# Altium schematic sheet Load_Cell_Acquisition.SchDoc
size A3; Organization: Altium Limited; Address1: L3, 12a Rodborough Rd; Address2: Frenchs Forest; Address3: NSW; Address4: Australia 2086; DocumentNumber: 2; SheetNumber: 2; SheetTotal: 8
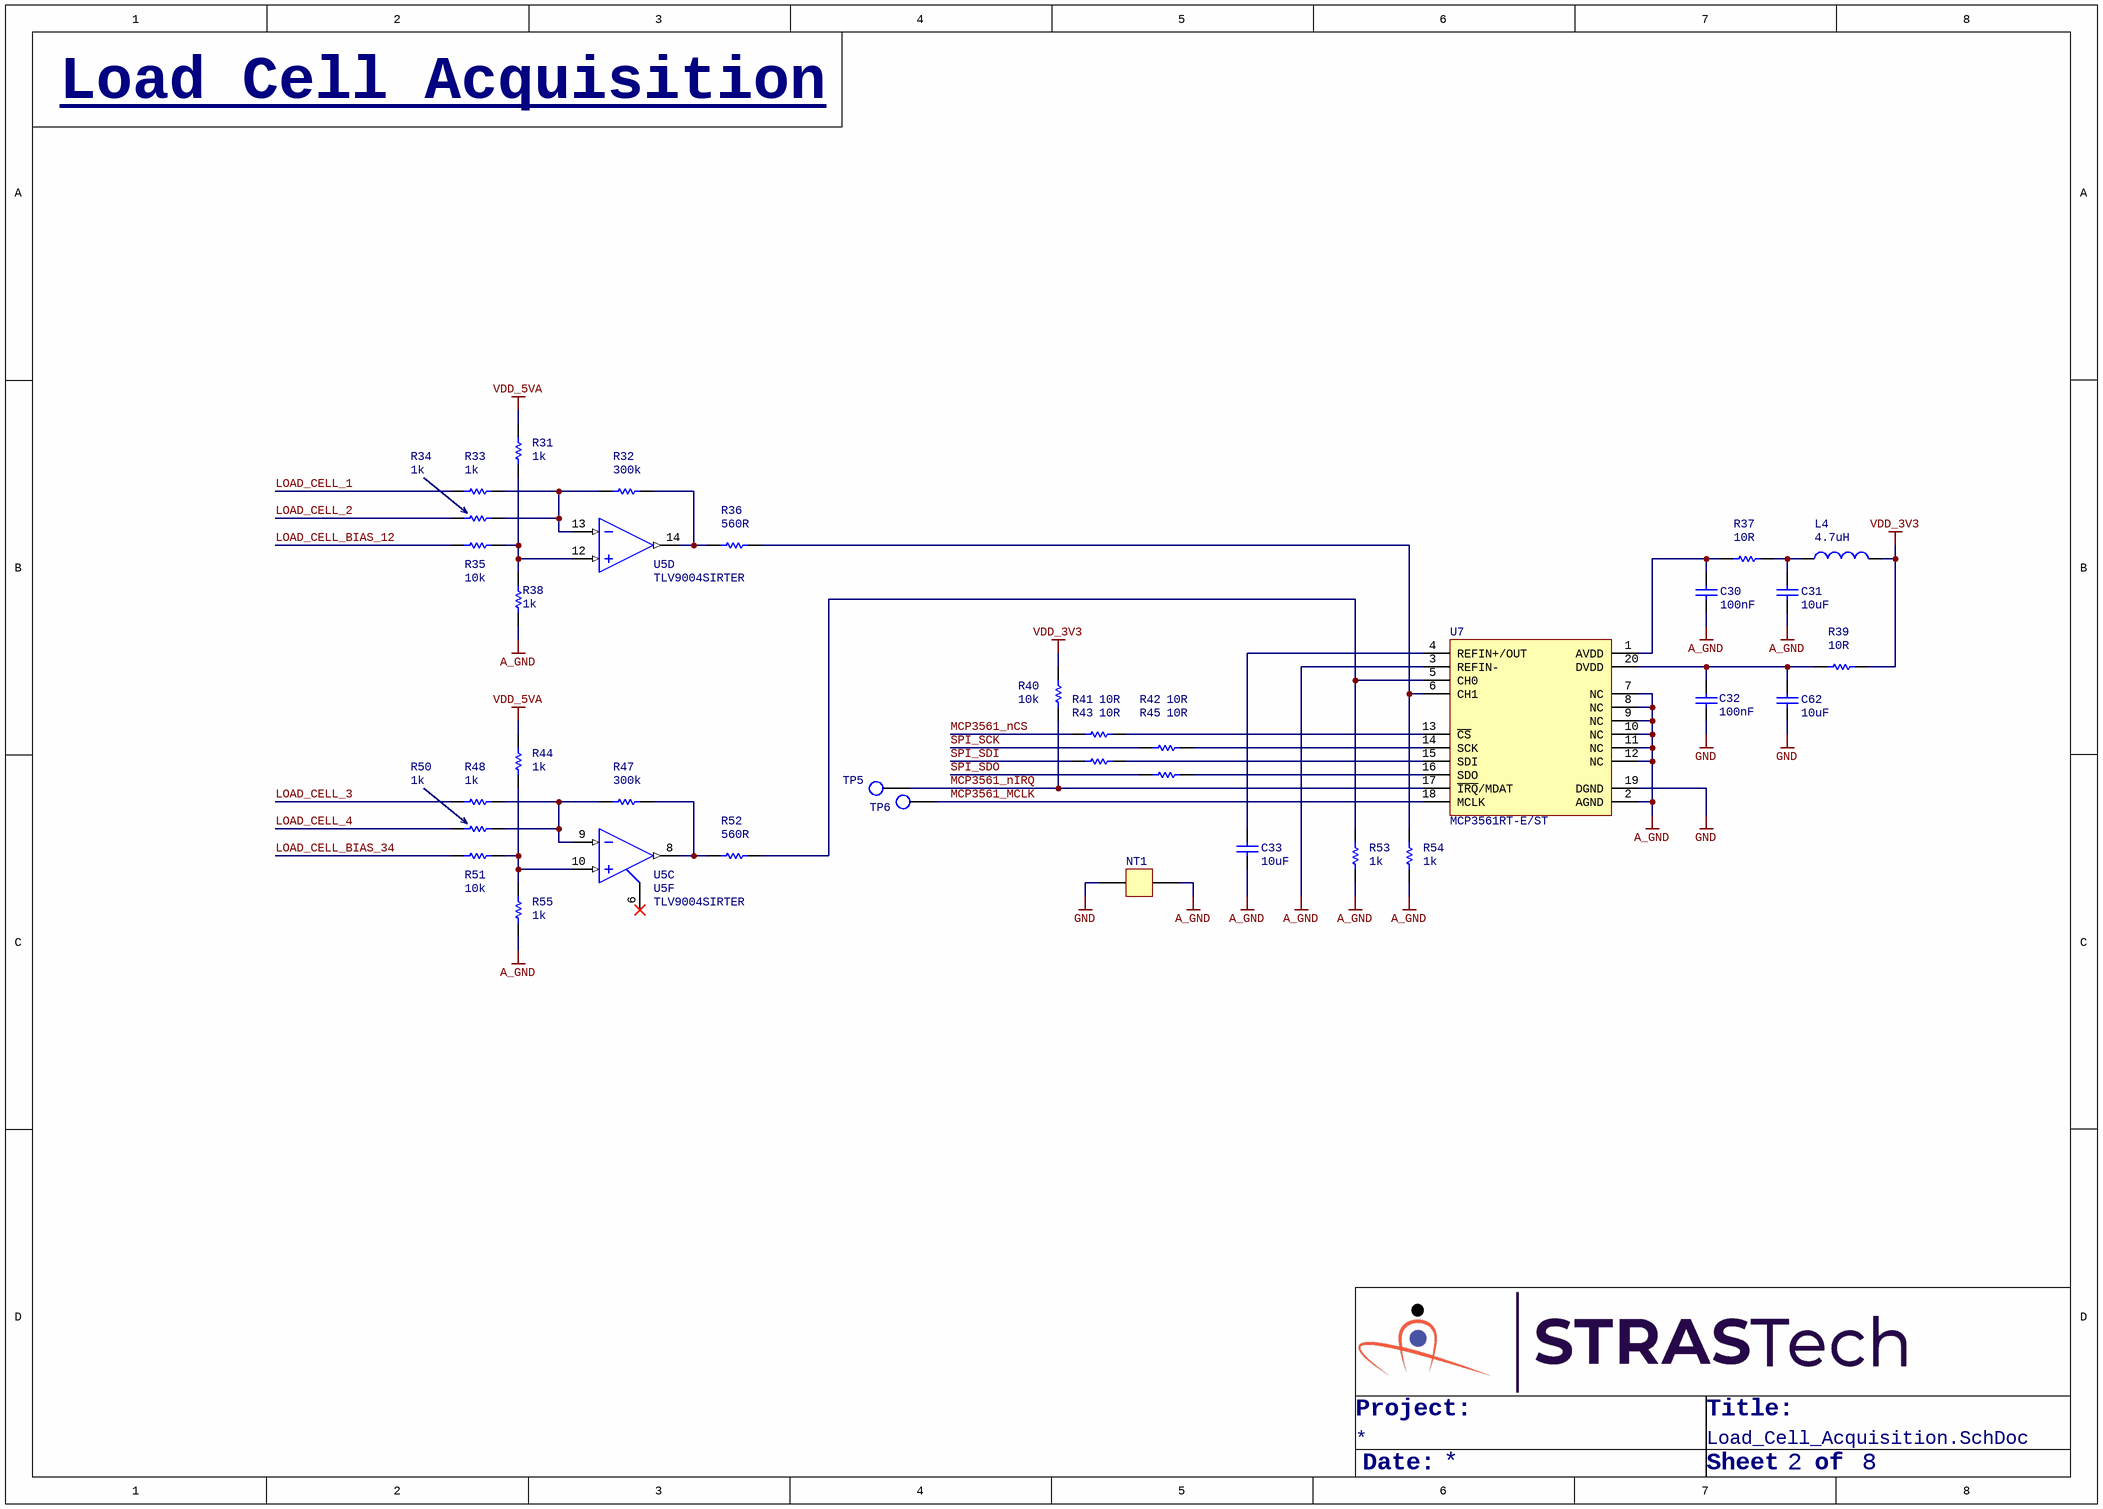
[diagram p0: Load_Cell_Acquisition.SchDoc]

## Parts
C30  100nF  [Cap,SMD,0402]
C31  10uF  [Cap,SMD,0402]
C32  100nF  [Cap,SMD,0402]
C33  10uF  [Cap,SMD,0402]
C62  10uF  [Cap,SMD,0402]
L4  4.7uH  [IND,0805]
NT1  Net Tie  [Net Tie,20x60mil]  (value not drawn)  (net tie, no BOM)
R31  1k  [RES,0402]
R32  300k  [RES,0402]
R33  1k  [RES,0402]
R34  1k  [RES,0402]
R35  10k  [RES,0402]
R36  560R  [RES,0402]
R37  10R  [RES,0402]
R38  1k  [RES,0402]
R39  10R  [RES,0402]
R40  10k  [RES,0402]
R41  10R  [RES,0402]
R42  10R  [RES,0402]
R43  10R  [RES,0402]
R44  1k  [RES,0402]
R45  10R  [RES,0402]
R47  300k  [RES,0402]
R48  1k  [RES,0402]
R50  1k  [RES,0402]
R51  10k  [RES,0402]
R52  560R  [RES,0402]
R53  1k  [RES,0402]
R54  1k  [RES,0402]
R55  1k  [RES,0402]
TP5  TESTPOINT  [testpoint,smd,round,1mm]  (value not drawn)
TP6  TESTPOINT  [testpoint,smd,round,1mm]  (value not drawn)
U5  TLV9004SIRTER  [IC,QFN-16,3x3]  (parts C,D,F of 8)
U7  MCP3561RT-E/ST  [IC,TSSOP-20,W4.4]

## Nets
A_GND: C30.1 C31.2 C33.1 NT1.2 R38.1 R53.2 R54.2 R55.1 U7.2(AGND) U7.3(REFIN-) U7.7(NC) U7.8(NC) U7.9(NC) U7.10(NC) U7.11(NC) U7.12(NC)
GND: C32.1 C62.2 NT1.1 U7.19(DGND)
VDD_3V3: L4.2 R39.2 R40.2
VDD_5VA: R31.2 R44.2
LOAD_CELL_1: R33.2
LOAD_CELL_2: R34.2
LOAD_CELL_3: R48.2
LOAD_CELL_4: R50.2
LOAD_CELL_BIAS_12: R35.1
LOAD_CELL_BIAS_34: R51.1
MCP3561_MCLK: TP6.1(TP) U7.18(MCLK)
MCP3561_nCS: R41.1
MCP3561_nIRQ: R40.1 TP5.1(TP) U7.17(~{IRQ}/MDAT)
SPI_SCK: R42.1
SPI_SDI: R43.1
SPI_SDO: R45.1
NetC30_2: C30.2 R37.1 U7.1(AVDD)
NetC31_1: C31.1 L4.1 R37.2
NetC32_2: C32.2 C62.1 R39.1 U7.20(DVDD)
NetC33_2: C33.2 U7.4(REFIN+/OUT)
NetR31_1: R31.1 R35.2 R38.2 U5.12(IN4+)
NetR32_1: R32.1 R36.2 U5.14(OUT4)
NetR32_2: R32.2 R33.1 R34.1 U5.13(IN4-)
NetR36_1: R36.1 R54.1 U7.6(CH1)
NetR41_2: R41.2 U7.13(~{CS})
NetR42_2: R42.2 U7.14(SCK)
NetR43_2: R43.2 U7.15(SDI)
NetR44_1: R44.1 R51.2 R55.2 U5.10(IN3+)
NetR45_2: R45.2 U7.16(SDO)
NetR47_1: R47.1 R52.2 U5.8(OUT3)
NetR47_2: R47.2 R48.1 R50.1 U5.9(IN3-)
NetR52_1: R52.1 R53.1 U7.5(CH0)

Not connected (* = marked no-connect by the designer): U5 6(~{SHDN}12)*

## Notes on the sheet
- Load Cell Acquisition
- Project:
- Title:
- Date:
- Sheet
- of
- Title
- Size:
- A3
- Revision:
- Design By:

## Library data of the parts
C30 C32 = CAP,Cer,100nF,25VDC,X7R,0402: 0.1µF ±10% 25V Ceramic Capacitor X7R 0402 (1005 Metric); Vendor Part Number: 490-14603-1-ND; Manufacturer: Murata Electronics; Manufacturer Part Number: GRM155R71E104KE14J; Vendor: Digikey; HelpURL: https://search.murata.co.jp/Ceramy/image/img/A01X/G101/ENG/GRM155R71E104KE14-01.pdf; CreatedBy: Judd Foster
C31 C33 C62 = CAP,Cer,10uF,10VDC,X5R,0402: 10 µF ±20% 10V Ceramic Capacitor X5R 0402 (1005 Metric); Vendor Part Number: 1276-1450-1-ND; Manufacturer: Samsung Electro-Mechanics; Manufacturer Part Number: CL05A106MP5NUNC; Vendor: Digikey; HelpURL: https://media.digikey.com/pdf/Data%20Sheets/Samsung%20PDFs/CL05A106MP5NUNC_Spec.pdf; CreatedBy: Judd Foster
L4 = IND,4.7uH,80mA,Multilayer,0805: 4.7 µH Shielded Multilayer Inductor 80 mA 300mOhm 0805 (2012 Metric); Vendor Part Number: 445-3169-1-ND; Manufacturer: TDK Corporation; Manufacturer Part Number: MLZ2012E4R7MT000; Vendor: Digikey; HelpURL: https://product.tdk.com/en/system/files?file=dam/doc/product/inductor/inductor/smd/catalog/inductor_commercial_decoupling_mlz2012_en.pdf; CreatedBy: Judd Foster
R31 R33 R34 R38 R44 R48 R50 R53-R55 = RES,1k,5%,0.063W,0402: 1 kOhms ±5% 0.063W, 1/16W Chip Resistor 0402 (1005 Metric) Automotive AEC-Q200 Thick Film; Vendor Part Number: RMCF0402JT1K00CT-ND; Manufacturer: Stackpole Electronics Inc; Manufacturer Part Number: RMCF0402JT1K00; Vendor: DIgikey; HelpURL: https://www.seielect.com/catalog/sei-rmcf_rmcp.pdf; CreatedBy: Judd Foster
R32 R47 = RES,300k,1%,0.063W,0402: 300 kOhms ±1% 0.063W, 1/16W Chip Resistor 0402 (1005 Metric) Automotive AEC-Q200 Thick Film; Manufacturer: Stackpole Electronics Inc; Manufacturer Part Number: RMCF0402FT300K; Vendor Part Number: RMCF0402FT300KCT-ND; Vendor: Digikey; CreatedBy: Judd Foster; HelpURL: https://www.seielect.com/catalog/sei-rmcf_rmcp.pdf
R35 R40 R51 = RES,10k,5%,0.063W,0402: 10 kOhms ±5% 0.063W, 1/16W Chip Resistor 0402 (1005 Metric) Automotive AEC-Q200 Thick Film; Vendor Part Number: RMCF0402JT10K0CT-ND; Manufacturer: Stackpole Electronics Inc; Manufacturer Part Number: RMCF0402JT10K0; Vendor: DIgikey; HelpURL: https://www.seielect.com/catalog/sei-rmcf_rmcp.pdf; CreatedBy: Judd Foster
R36 R52 = RES,560R,1%,0.063W,0402: 560 Ohms ±1% 0.063W, 1/16W Chip Resistor 0402 (1005 Metric) Automotive AEC-Q200, Moisture Resistant Thick Film; Manufacturer: TE Connectivity Passive Product; Manufacturer Part Number: CRGCQ0402F560R; Vendor Part Number: A129624CT-ND; Vendor: Digikey; CreatedBy: Judd Foster; HelpURL: https://www.te.com/commerce/DocumentDelivery/DDEController?Action=srchrtrv&DocNm=1773204-3&DocType=DS&DocLang=English
R37 R39 R41-R43 R45 = RES,10R,1%,0.063W,0402: 10 Ohms ±1% 0.063W, 1/16W Chip Resistor 0402 (1005 Metric) Automotive AEC-Q200 Thick Film; Manufacturer: Panasonic Electronic Components; Manufacturer Part Number: ERJ-2RKF10R0X; Vendor Part Number: P10.0LCT-ND; Vendor: Digikey; CreatedBy: Judd Foster; HelpURL: https://industrial.panasonic.com/cdbs/www-data/pdf/RDA0000/AOA0000C304.pdf
TP5 TP6 = TESTPOINT: PCB Testpoint; CreatedBy: Judd Foster; HelpURL: N/A; Manufacturer: N/A; Manufacturer Part Number: N/A; Vendor: N/A; Vendor Part Number: N/A
U5 = TLV9004SIRTER: General Purpose Amplifier 4 Circuit Rail-to-Rail 16-WQFN (3x3); Manufacturer: Texas Instruments; Vendor Part Number: 296-51829-1-ND; Vendor: Digikey; CreatedBy: Judd Foster; HelpURL: https://www.ti.com/general/docs/suppproductinfo.tsp?distId=10&gotoUrl=https%3A%2F%2Fwww.ti.com%2Flit%2Fgpn%2Ftlv9004; Manufacturer Part Number: TLV9004SIRTER
U7 = MCP3561RT-E/ST: 24 Bit Analog to Digital Converter 1 Input 1 Sigma-Delta 20-TSSOP; Vendor Part Number: 150-MCP3561RT-E/STCT-ND; Manufacturer: Microchip Technology; Vendor: Digikey; Manufacturer Part Number: MCP3561RT-E/ST; HelpURL: https://ww1.microchip.com/downloads/en/DeviceDoc/MCP3561.2.4R-Data-Sheet-DS200006391A.pdf; CreatedBy: Judd Foster
NT1 = Net Tie: CreatedBy: Makan Mousavi; HelpURL: N/A; Manufacturer: N/A; Manufacturer Part Number: N/A; Vendor: N/A; Vendor Part Number: N/A